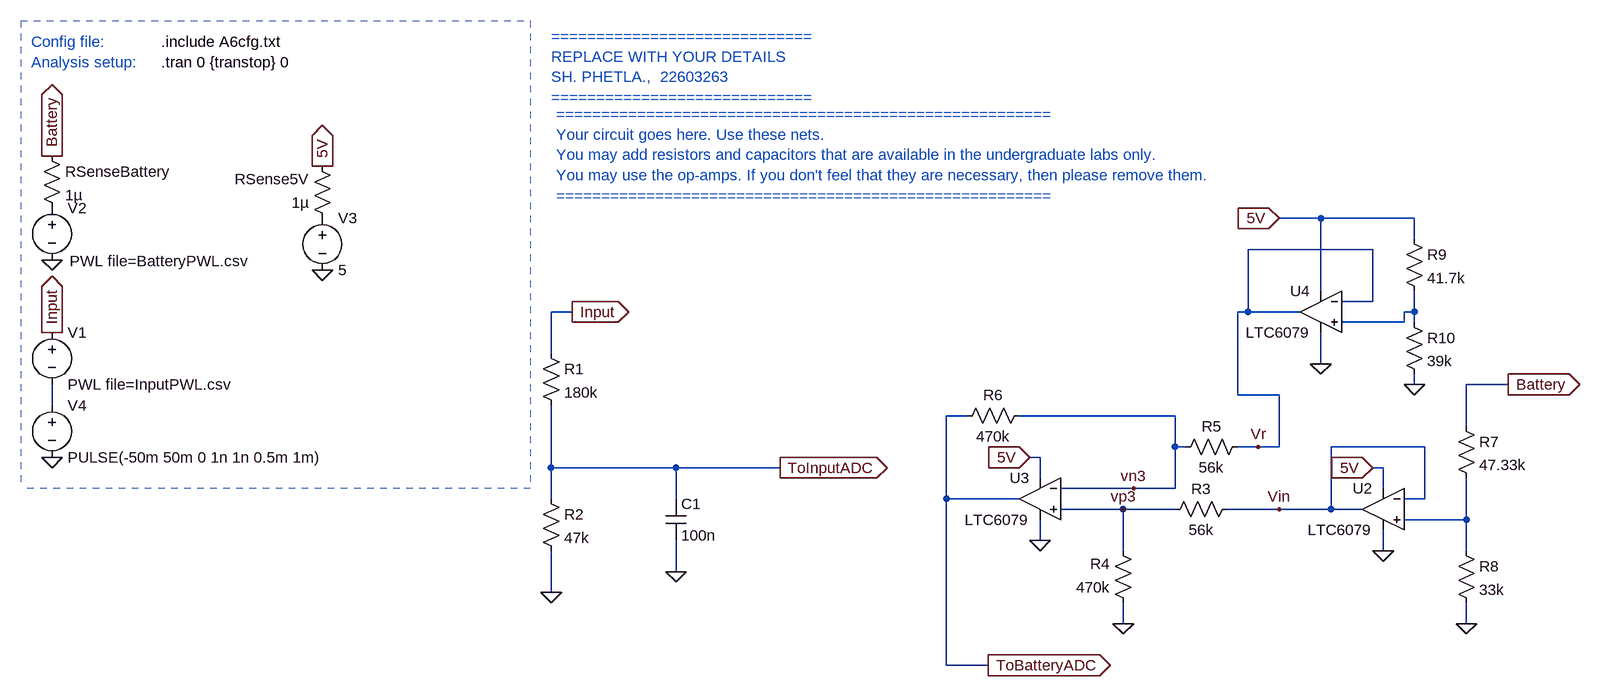
[diagram p0: schematic E344_22603263_A6.asc]
E344_22603263_A6.asc, the LTspice schematic file:
Version 4
SHEET 1 1824 680
WIRE -368 -1120 -432 -1120
WIRE -224 -1120 -368 -1120
WIRE -224 -1088 -224 -1120
WIRE -288 -1072 -480 -1072
WIRE -368 -1008 -368 -1120
WIRE -288 -992 -288 -1072
WIRE -288 -992 -336 -992
WIRE -1520 -976 -1552 -976
WIRE -480 -976 -480 -1072
WIRE -480 -976 -496 -976
WIRE -400 -976 -480 -976
WIRE -224 -976 -224 -1008
WIRE -224 -976 -240 -976
WIRE -240 -960 -240 -976
WIRE -240 -960 -336 -960
WIRE -224 -960 -224 -976
WIRE -1552 -912 -1552 -976
WIRE -368 -896 -368 -944
WIRE -224 -864 -224 -880
WIRE -80 -864 -144 -864
WIRE -496 -848 -496 -976
WIRE -432 -848 -496 -848
WIRE -2320 -832 -2320 -864
WIRE -912 -816 -944 -816
WIRE -592 -816 -832 -816
WIRE -144 -800 -144 -864
WIRE -592 -768 -592 -816
WIRE -576 -768 -592 -768
WIRE -464 -768 -496 -768
WIRE -432 -768 -432 -848
WIRE -432 -768 -464 -768
WIRE -208 -768 -352 -768
WIRE -800 -752 -816 -752
WIRE -1552 -736 -1552 -832
WIRE -1360 -736 -1552 -736
WIRE -1200 -736 -1360 -736
WIRE -272 -736 -288 -736
WIRE -800 -720 -800 -752
WIRE -656 -704 -768 -704
WIRE -592 -704 -592 -768
WIRE -592 -704 -656 -704
WIRE -272 -704 -272 -736
WIRE -1552 -688 -1552 -736
WIRE -1360 -688 -1360 -736
WIRE -944 -688 -944 -816
WIRE -832 -688 -944 -688
WIRE -208 -688 -208 -768
WIRE -208 -688 -240 -688
WIRE -672 -672 -768 -672
WIRE -592 -672 -672 -672
WIRE -432 -672 -512 -672
WIRE -352 -672 -352 -768
WIRE -352 -672 -432 -672
WIRE -304 -672 -352 -672
WIRE -144 -656 -144 -720
WIRE -144 -656 -240 -656
WIRE -800 -624 -800 -656
WIRE -672 -608 -672 -672
WIRE -272 -608 -272 -640
WIRE -144 -608 -144 -656
WIRE -1360 -576 -1360 -624
WIRE -1552 -544 -1552 -608
WIRE -672 -496 -672 -528
WIRE -144 -496 -144 -528
WIRE -944 -432 -944 -688
WIRE -880 -432 -944 -432
FLAG -2320 -944 Input
IOPIN -2320 -944 Out
FLAG -1904 -1040 0
FLAG -1552 -544 0
FLAG -2320 -752 0
FLAG -2320 -1056 0
FLAG -1200 -736 ToInputADC
IOPIN -1200 -736 Out
FLAG -880 -432 ToBatteryADC
IOPIN -880 -432 Out
FLAG -1904 -1200 5V
IOPIN -1904 -1200 Out
FLAG -2320 -1216 Battery
IOPIN -2320 -1216 Out
FLAG -80 -864 Battery
IOPIN -80 -864 Out
FLAG -1520 -976 Input
IOPIN -1520 -976 Out
FLAG -672 -496 0
FLAG -144 -496 0
FLAG -272 -608 0
FLAG -800 -624 0
FLAG -816 -752 5V
IOPIN -816 -752 In
FLAG -288 -736 5V
IOPIN -288 -736 In
FLAG -432 -1120 5V
IOPIN -432 -1120 In
FLAG -368 -896 0
FLAG -672 -672 vp3
FLAG -656 -704 vn3
FLAG -432 -672 Vin
FLAG -464 -768 Vr
FLAG -1360 -576 0
FLAG -224 -864 0
SYMBOL voltage -2320 -960 R0
WINDOW 123 0 0 Left 0
WINDOW 39 0 0 Left 0
SYMATTR InstName V1
SYMATTR Value PWL file=InputPWL.csv
SYMBOL voltage -2320 -1152 R0
WINDOW 123 0 0 Left 0
WINDOW 39 0 0 Left 0
WINDOW 3 27 98 Left 2
SYMATTR Value PWL file=BatteryPWL.csv
SYMATTR InstName V2
SYMBOL voltage -1904 -1136 R0
WINDOW 123 0 0 Left 0
WINDOW 39 0 0 Left 0
SYMATTR InstName V3
SYMATTR Value 5
SYMBOL voltage -2320 -848 R0
WINDOW 123 0 0 Left 0
WINDOW 39 0 0 Left 0
SYMATTR InstName V4
SYMATTR Value PULSE(-50m 50m 0 1n 1n 0.5m 1m)
SYMBOL res -1888 -1104 R180
WINDOW 0 36 76 Left 2
WINDOW 3 36 40 Left 2
SYMATTR InstName RSense5V
SYMATTR Value 1µ
SYMBOL res -2336 -1232 R0
SYMATTR InstName RSenseBattery
SYMATTR Value 1µ
SYMBOL OpAmps\\LTC6079 -272 -672 M0
SYMATTR InstName U2
SYMBOL OpAmps\\LTC6079 -800 -688 M0
SYMATTR InstName U3
SYMBOL res -1568 -928 R0
SYMATTR InstName R1
SYMATTR Value 180k
SYMATTR SpiceLine tol=5
SYMBOL res -1568 -704 R0
SYMATTR InstName R2
SYMATTR Value 47k
SYMATTR SpiceLine tol=5
SYMBOL res -496 -688 R90
WINDOW 0 0 56 VBottom 2
WINDOW 3 32 56 VTop 2
SYMATTR InstName R3
SYMATTR Value 56k
SYMATTR SpiceLine tol=5
SYMBOL res -656 -512 R180
WINDOW 0 36 76 Left 2
WINDOW 3 36 40 Left 2
SYMATTR InstName R4
SYMATTR Value 470k
SYMATTR SpiceLine tol=5
SYMBOL res -592 -752 R270
WINDOW 0 32 56 VTop 2
WINDOW 3 0 56 VBottom 2
SYMATTR InstName R5
SYMATTR Value 56k
SYMATTR SpiceLine tol=5
SYMBOL res -928 -800 R270
WINDOW 0 32 56 VTop 2
WINDOW 3 0 56 VBottom 2
SYMATTR InstName R6
SYMATTR Value 470k
SYMATTR SpiceLine tol=5
SYMBOL res -160 -816 R0
SYMATTR InstName R7
SYMATTR Value 47.33k
SYMATTR SpiceLine tol=5
SYMBOL res -160 -624 R0
SYMATTR InstName R8
SYMATTR Value 33k
SYMATTR SpiceLine tol=5
SYMBOL res -240 -1104 R0
SYMATTR InstName R9
SYMATTR Value 41.7k
SYMATTR SpiceLine tol=5
SYMBOL res -240 -976 R0
SYMATTR InstName R10
SYMATTR Value 39k
SYMATTR SpiceLine tol=5
SYMBOL Opamps\\LTC6079 -368 -976 M0
SYMATTR InstName U4
SYMBOL cap -1376 -688 R0
SYMATTR InstName C1
SYMATTR Value 100n
TEXT -2152 -1360 Left 2 !.tran 0 {transtop} 0
TEXT -2152 -1392 Left 2 !.include A6cfg.txt
TEXT -2352 -1392 Left 2 ;Config file:
TEXT -2352 -1360 Left 2 ;Analysis setup:
TEXT -1552 -1400 Left 2 ;=============================\nREPLACE WITH YOUR DETAILS\nSH. PHETLA.,  22603263\n=============================
TEXT -1544 -1280 Left 2 ;=======================================================\nYour circuit goes here. Use these nets.\nYou may add resistors and capacitors that are available in the undergraduate labs only.\nYou may use the op-amps. If you don't feel that they are necessary, then please remove them.\n=======================================================
LINE Normal -1584 -1424 -1584 -704 2
LINE Normal -2368 -1424 -1584 -1424 2
LINE Normal -1584 -704 -2368 -704 2
LINE Normal -1584 -720 -1584 -720 2
LINE Normal -2368 -1424 -2368 -704 2

The netlist it stands for:
* E344_22603263_A6.asc
V1 Input N002 PWL file=InputPWL.csv
V2 P001 0 PWL file=BatteryPWL.csv
V3 P002 0 5
V4 N002 0 PULSE(-50m 50m 0 1n 1n 0.5m 1m)
RSense5V P002 5V 1µ
RSenseBattery Battery P001 1µ
XU2 N003 Vin 5V 0 Vin LTC6078  ; LTC6079, pins In+ In- V+ V- OUT
XU3 vp3 vn3 5V 0 ToBatteryADC LTC6078  ; LTC6079, pins In+ In- V+ V- OUT
R1 Input ToInputADC 180k tol=5
R2 ToInputADC 0 47k tol=5
R3 Vin vp3 56k tol=5
R4 0 vp3 470k tol=5
R5 vn3 Vr 56k tol=5
R6 ToBatteryADC vn3 470k tol=5
R7 Battery N003 47.33k tol=5
R8 N003 0 33k tol=5
R9 5V N001 41.7k tol=5
R10 N001 0 39k tol=5
XU4 N001 Vr 5V 0 Vr LTC6078  ; LTC6079, pins In+ In- V+ V- OUT
C1 ToInputADC 0 100n
.tran 0 {transtop} 0
.include A6cfg.txt
* Config file:
* Analysis setup:
* =============================
* REPLACE WITH YOUR DETAILS
* SH. PHETLA.,  22603263
* =============================
* =======================================================
* Your circuit goes here. Use these nets.
* You may add resistors and capacitors that are available in the undergraduate labs only.
* You may use the op-amps. If you don't feel that they are necessary, then please remove them.
* =======================================================
.lib LTC5.lib
.backanno
.end